# EasyEDA Pro project NRMgmtCRB_v2_final.epro, schematic Schematic1, sheets 2 to 3 of 3

## Sheets
2 Power
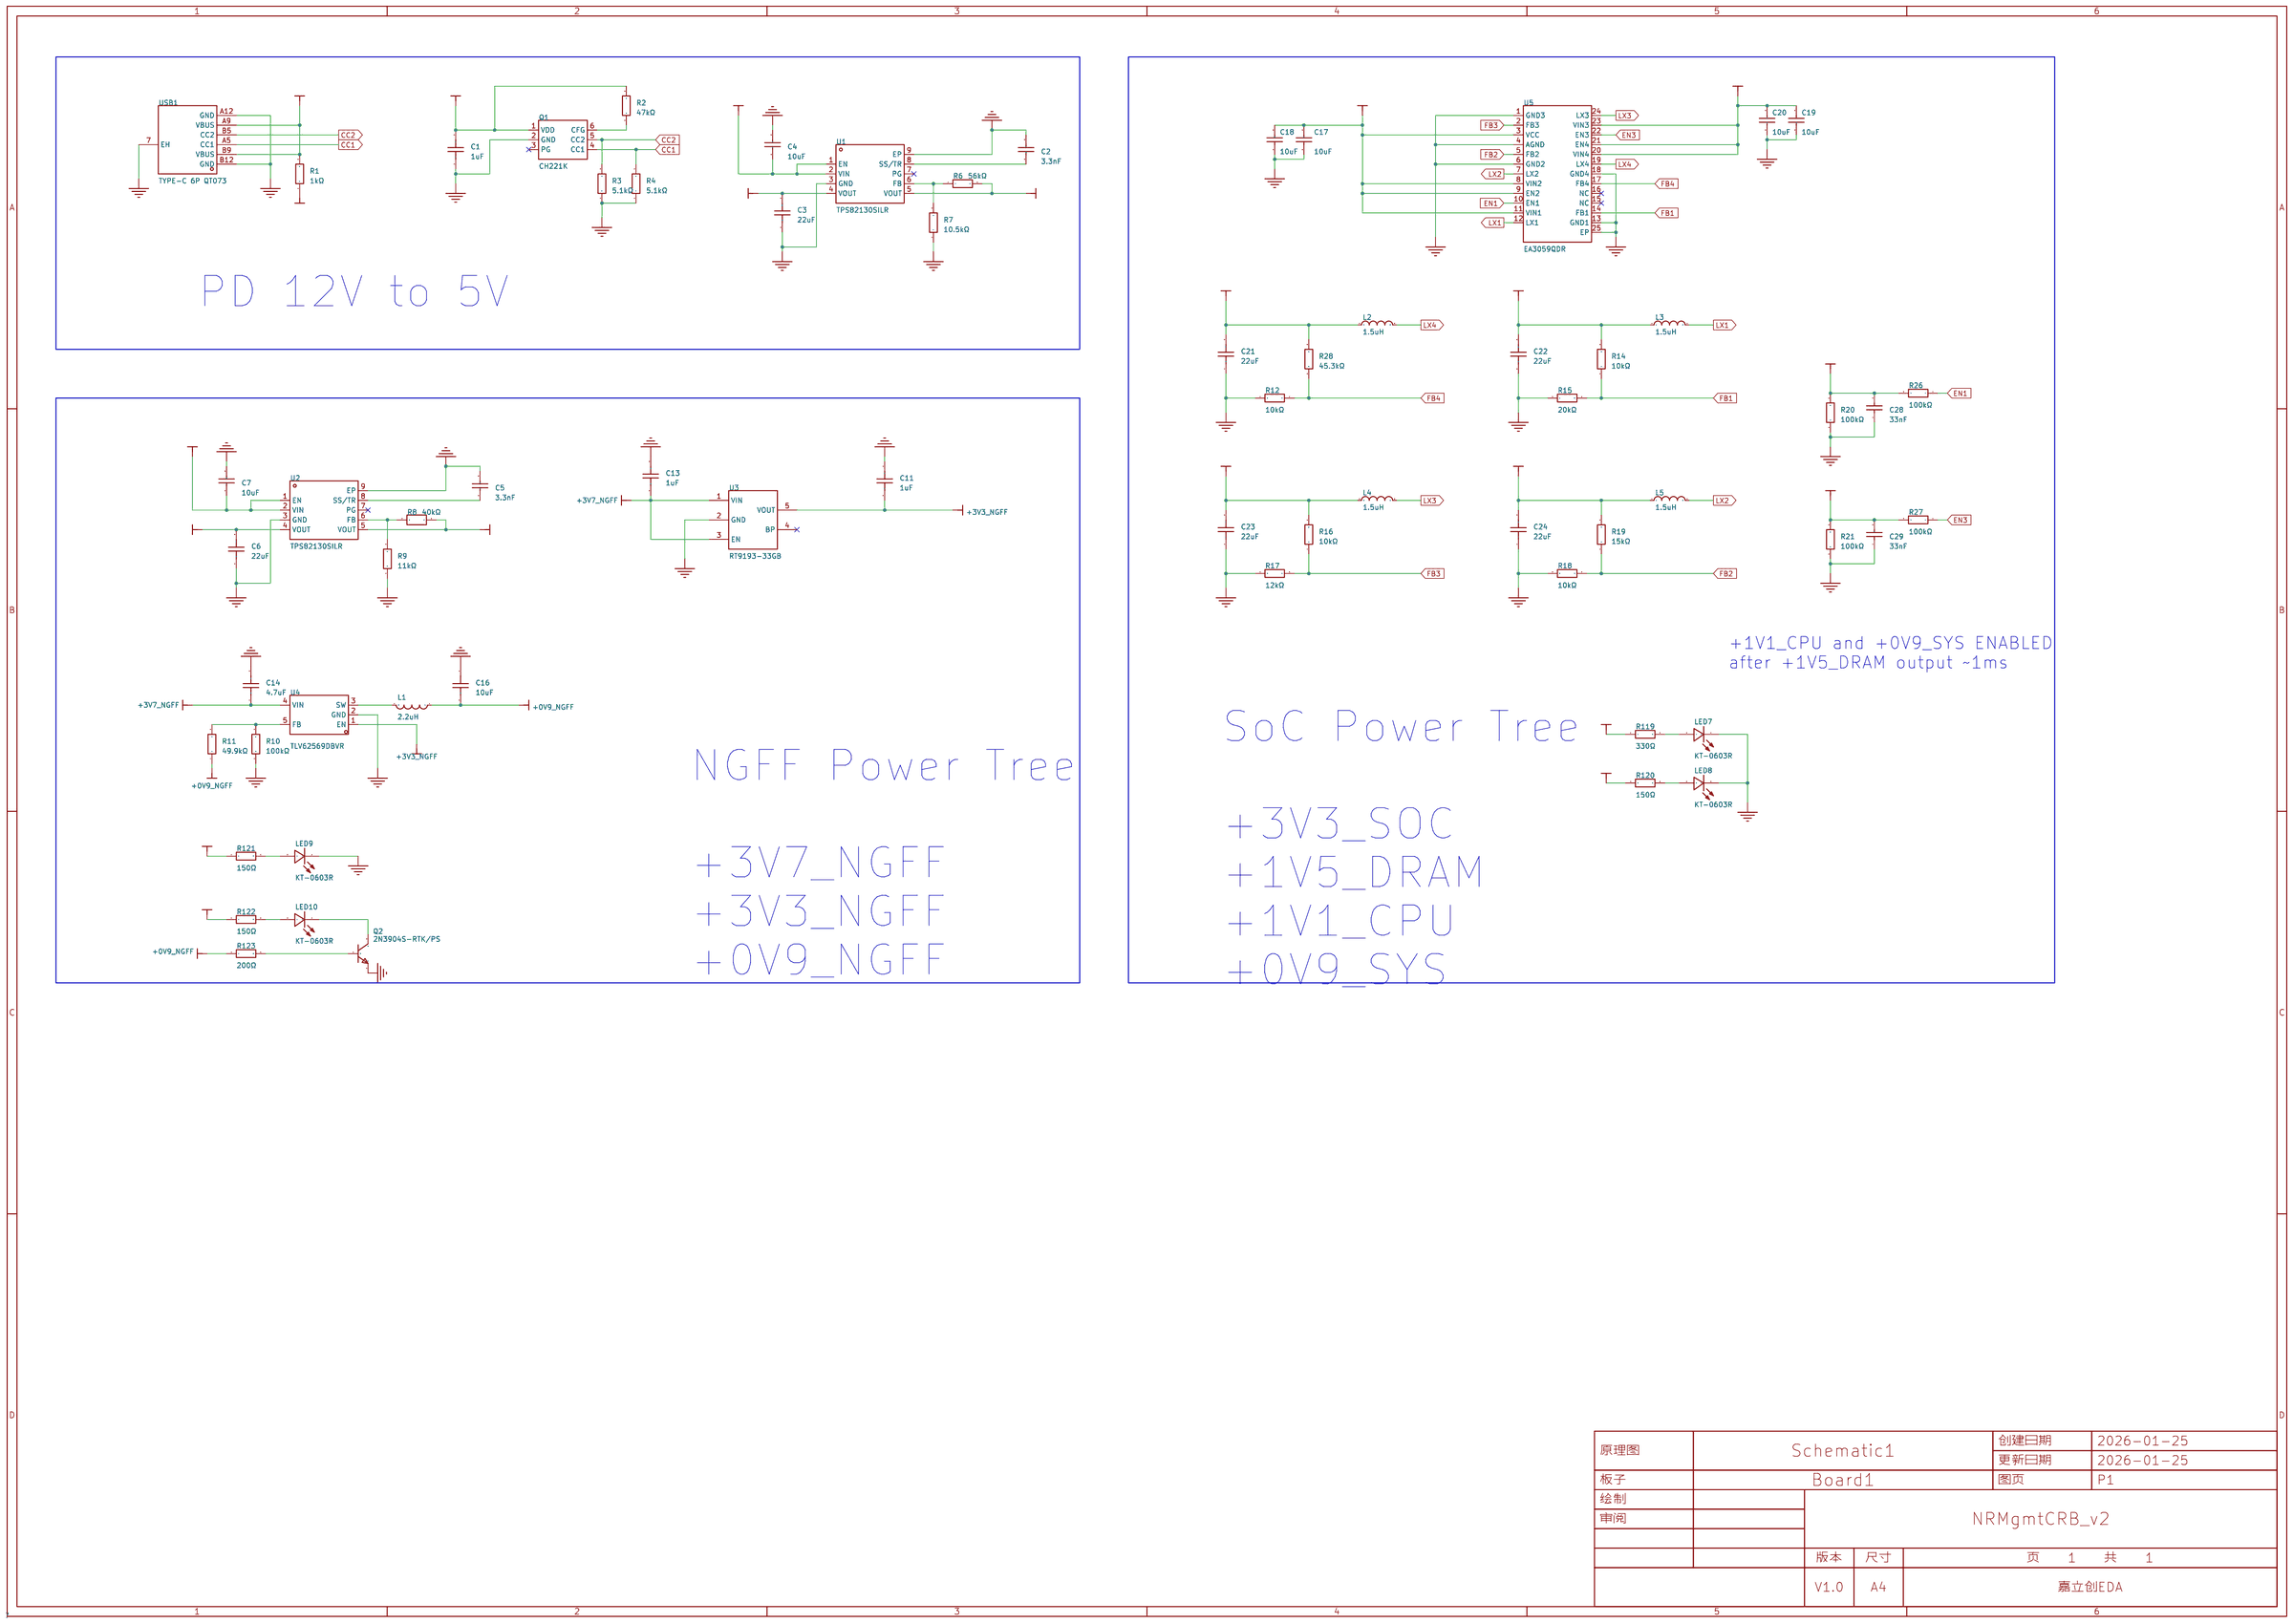
[diagram p1: Power]
3 NR
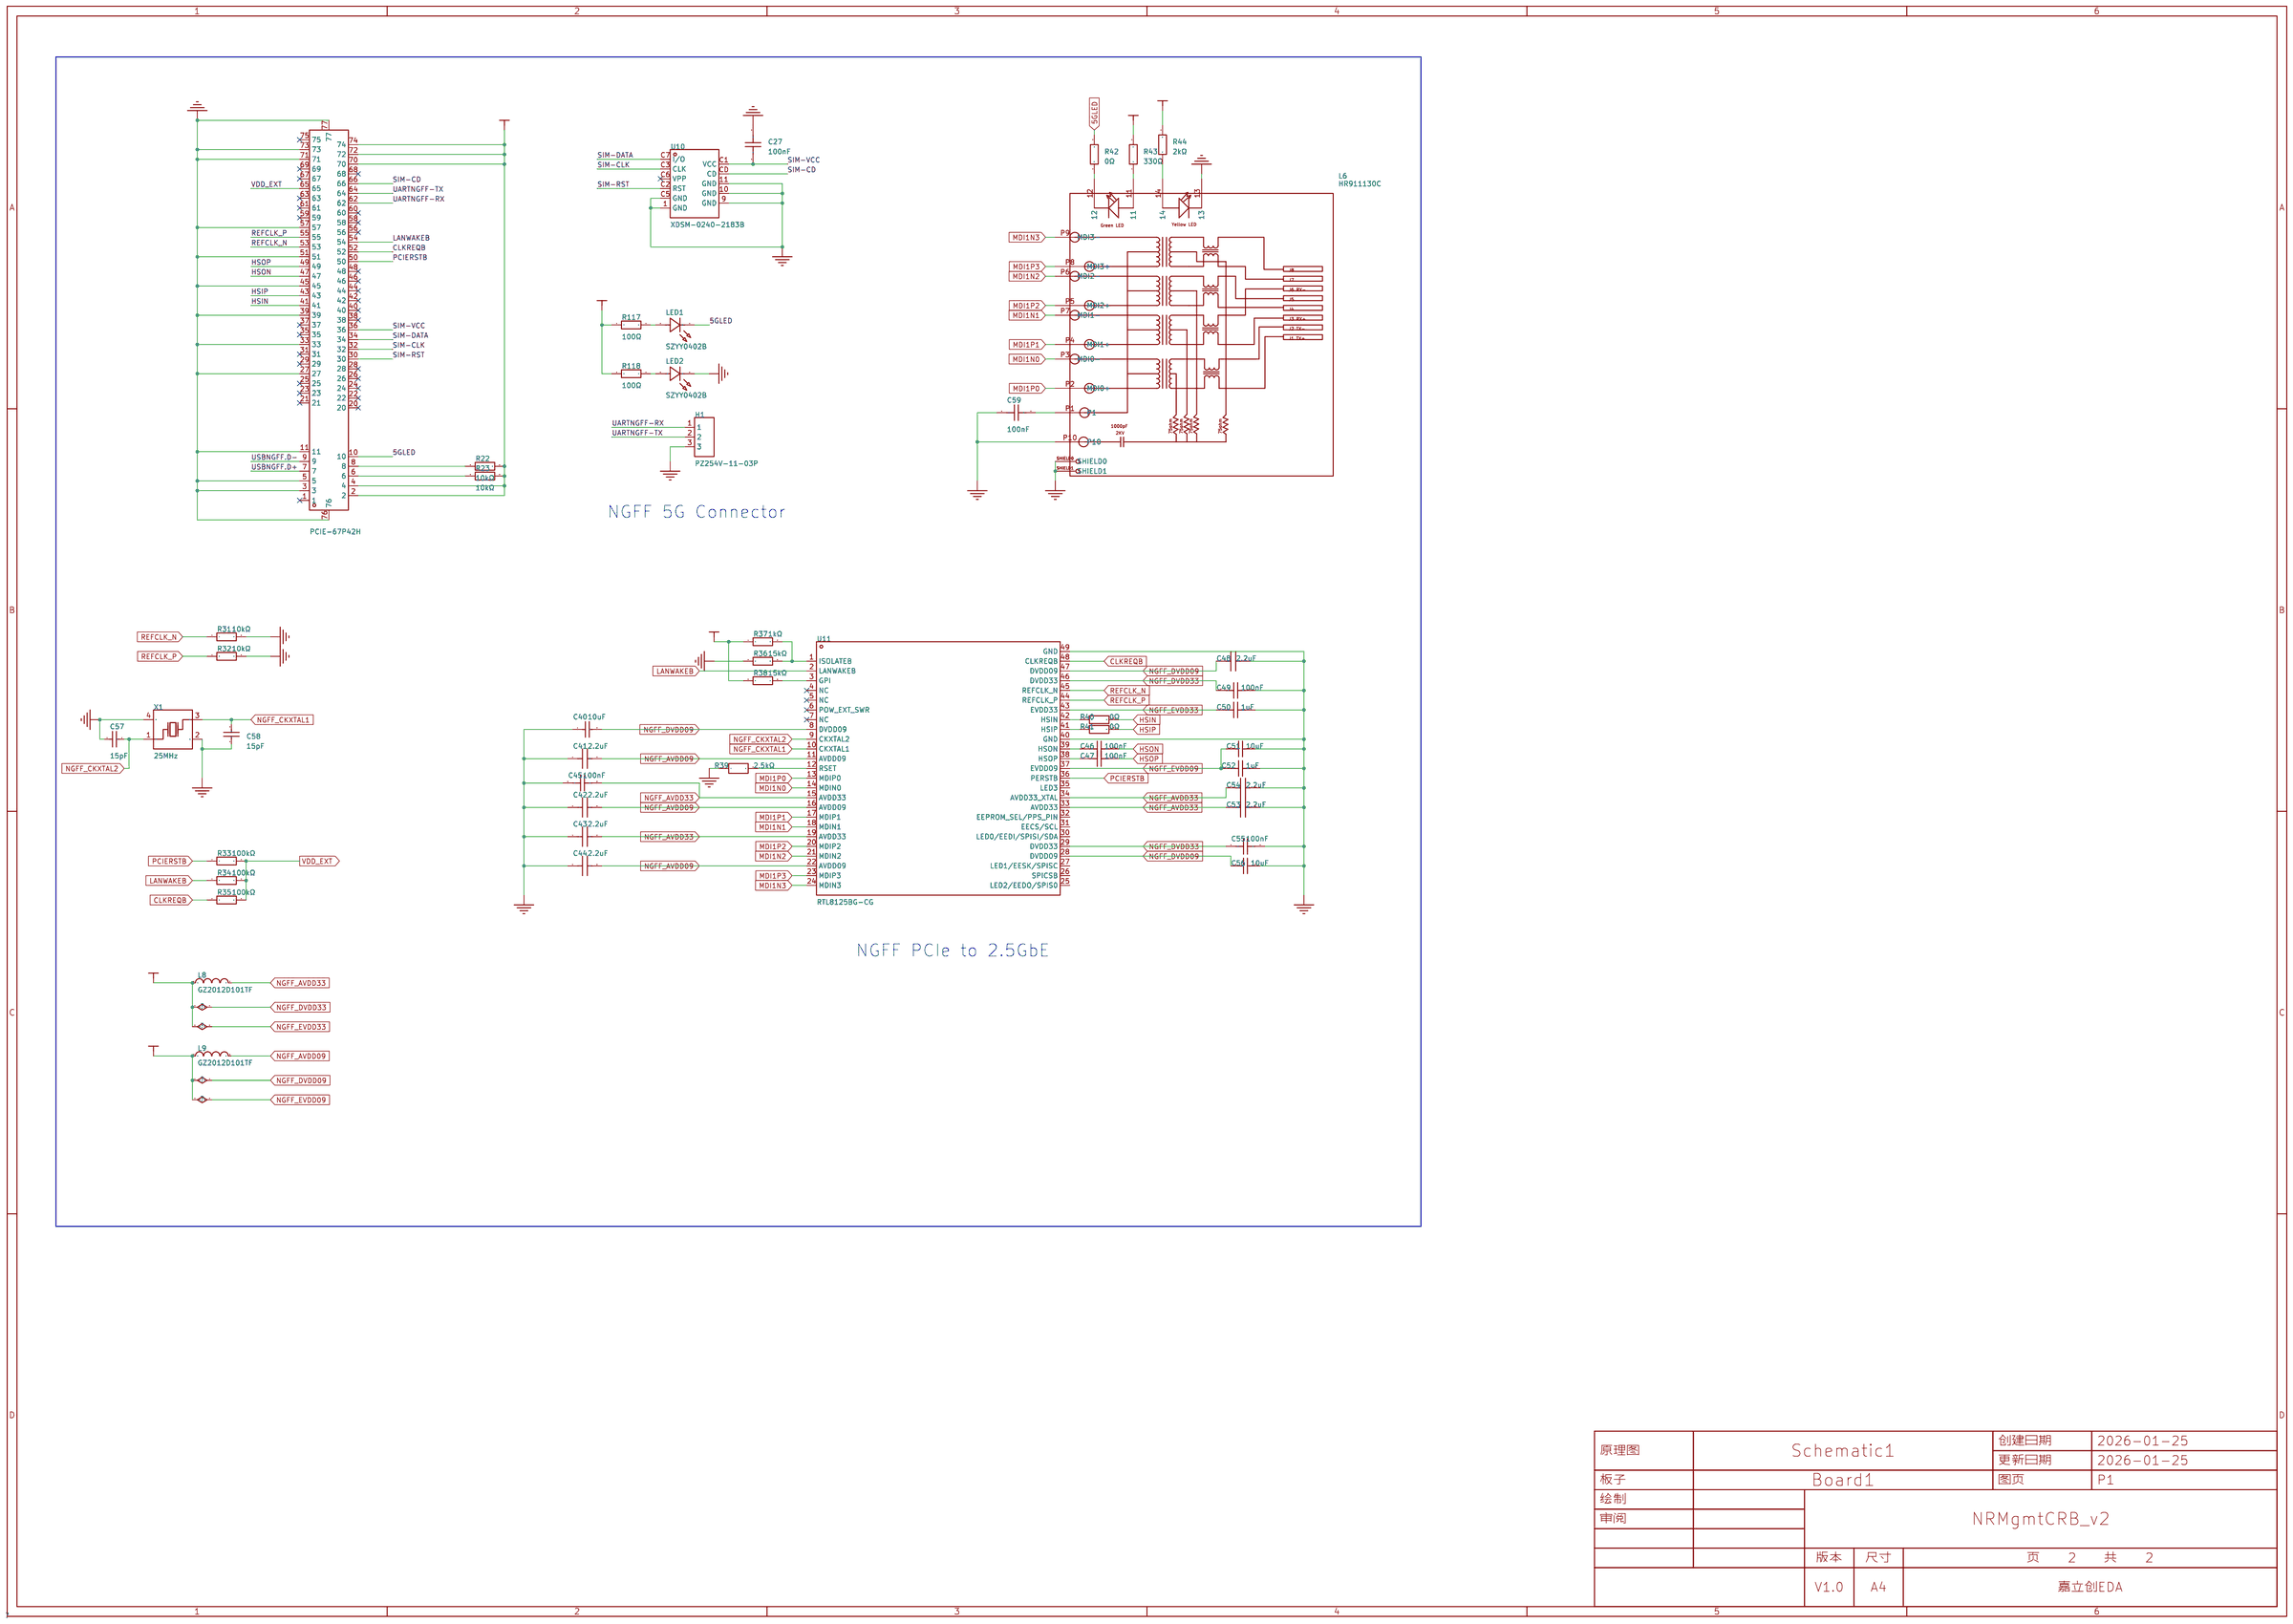
[diagram p2: NR]

## Parts
sheet NR
C27  100nF  [C0603]
C40  10uF  [C0402]
C41  2.2uF  [C0402]
C42  2.2uF  [C0402]
C43  2.2uF  [C0402]
C44  2.2uF  [C0402]
C45  100nF  [C0402]
C46  100nF  [C0402]
C47  100nF  [C0402]
C48  2.2uF  [C0402]
C49  100nF  [C0402]
C50  1uF  [C0402]
C51  10uF  [C0402]
C52  1uF  [C0402]
C53  2.2uF  [C0402]
C54  2.2uF  [C0402]
C55  100nF  [C0402]
C56  10uF  [C0402]
C57  15pF  [C0402]
C58  15pF  [C0402]
C59  100nF  [C0603]
H1  PZ254V-11-03P  [HDR-TH_3P-P2.54-V-M_PZ254V-11-03P]
L6  HR911130C  [RJ45-TH_HR911130C]
L8  GZ2012D101TF  [L0805]
L9  GZ2012D101TF  [L0805]
LED1  SZYY0402B  [LED0402-RD_BLUE]
LED2  SZYY0402B  [LED0402-RD_BLUE]
R22  10kΩ  [R0603]
R23  10kΩ  [R0603]
R31  10kΩ  [R0402]
R32  10kΩ  [R0402]
R33  100kΩ  [R0402]
R34  100kΩ  [R0402]
R35  100kΩ  [R0402]
R36  15kΩ  [R0402]
R37  1kΩ  [R0402]
R38  15kΩ  [R0402]
R39  2.5kΩ  [R0603]
R40  0Ω  [R0402]
R41  0Ω  [R0402]
R42  0Ω  [R0402]
R43  330Ω  [R0402]
R44  2kΩ  [R0402]
R117  100Ω  [R0402]
R118  100Ω  [R0402]
U6  PCIE-67P42H  [PCIE-SMD_75P-P0.50_HYC01B-05NGFF-420]
U10  XDSM-0240-2183B  [SIM-SMD_XDSM-0240-2183B]
U11  RTL8125BG-CG  [TQFN-48_L6.0-W6.0-P0.40-BL-EP4.5]
X1  25MHz  [CRYSTAL-SMD_4P-L3.2-W2.5-BL]
sheet Power
C1  1uF  [C0402]
C2  3.3nF  [C0603]
C3  22uF  [C0805]
C4  10uF  [C1206]
C5  3.3nF  [C0603]
C6  22uF  [C0805]
C7  10uF  [C1206]
C11  1uF  [C0603]
C13  1uF  [C0603]
C14  4.7uF  [C0805]
C16  10uF  [C0603]
C17  10uF  [C0402]
C18  10uF  [C0402]
C19  10uF  [C0402]
C20  10uF  [C0402]
C21  22uF  [C0603]
C22  22uF  [C0603]
C23  22uF  [C0603]
C24  22uF  [C0603]
C28  33nF  [C0603]
C29  33nF  [C0603]
L1  2.2uH  [IND-SMD_L2.5-W2.0_MHCHL2520]
L2  1.5uH  [IND-SMD_L2.5-W2.0_YXMBL252010P]
L3  1.5uH  [IND-SMD_L2.5-W2.0_YXMBL252010P]
L4  1.5uH  [IND-SMD_L2.5-W2.0_YXMBL252010P]
L5  1.5uH  [IND-SMD_L2.5-W2.0_YXMBL252010P]
LED7  KT-0603R  [LED0603-RD]
LED8  KT-0603R  [LED0603-RD]
LED9  KT-0603R  [LED0603-RD]
LED10  KT-0603R  [LED0603-RD]
Q1  CH221K  [SOT-23-6_L2.9-W1.6-P0.95-LS2.8-BL-2]
Q2  2N3904S-RTK/PS  [SOT-23-3_L2.9-W1.3-P1.90-LS2.4-TR]
R1  1kΩ  [R0402]
R2  47kΩ  [R0402]
R3  5.1kΩ  [R0402]
R4  5.1kΩ  [R0402]
R6  56kΩ  [R0603]
R7  10.5kΩ  [R0603]
R8  40kΩ  [R0603]
R9  11kΩ  [R0603]
R10  100kΩ  [R0603]
R11  49.9kΩ  [R0603]
R12  10kΩ  [R0402]
R14  10kΩ  [R0402]
R15  20kΩ  [R0402]
R16  10kΩ  [R0402]
R17  12kΩ  [R0402]
R18  10kΩ  [R0402]
R19  15kΩ  [R0402]
R20  100kΩ  [R0402]
R21  100kΩ  [R0402]
R26  100kΩ  [R0402]
R27  100kΩ  [R0402]
R28  45.3kΩ  [R0402]
R119  330Ω  [R0603]
R120  150Ω  [R0603]
R121  150Ω  [R0603]
R122  150Ω  [R0603]
R123  200Ω  [R0402]
U1  TPS82130SILR  [USIP-8_L3.0-W2.8-P0.65-TL-EP]
U2  TPS82130SILR  [USIP-8_L3.0-W2.8-P0.65-TL-EP]
U3  RT9193-33GB  [SOT-23-5_L3.0-W1.7-P0.95-LS2.8-BL]
U4  TLV62569DBVR  [SOT-23-5_L3.0-W1.7-P0.95-LS2.8-BR]
U5  EA3059QDR  [VQFN-24_L4.0-W4.0-P0.50-TL-EP2.5]
USB1  TYPE-C 6P QT073  [USB-C-SMD_TYPE-C-6P-QT073]

## Library data of the parts
C27 = CC0603KRX7R9BB104_1: 容值:100nF;精度:±10%;额定电压:50V;温度系数:X7R;; LCSC Part Name: 100nF ±10% 50V; Supplier Part: C14663; Manufacturer: YAGEO(国巨); Manufacturer Part: CC0603KRX7R9BB104; Supplier Footprint: 0603; JLCPCB Part Class: 基础库; Datasheet: https://item.szlcsc.com/datasheet/CC0603KRX7R9BB104/15331.html; Supplier: LCSC; Tolerance: ±10%; Voltage Rating: 50V; Temperature Coefficient: X7R; Check: false
C17-C20 C40 C51 C56 = CL05A106MQ5NUNC: 容值:10uF;精度:±20%;额定电压:6.3V;温度系数:X5R;; LCSC Part Name: 10uF ±20% 6.3V; Supplier Part: C15525; Manufacturer: SAMSUNG(三星); Supplier Footprint: 0402; JLCPCB Part Class: Basic Part; Datasheet: https://item.szlcsc.com/datasheet/CL05A106MQ5NUNC/16204.html; Supplier: LCSC; Tolerance: ±20%; Voltage Rating: 6.3V; Temperature Coefficient: X5R
C41-C44 C48 C53 C54 = CL05A225MQ5NSNC: 容值:2.2uF;精度:±20%;额定电压:6.3V;温度系数:X5R;; LCSC Part Name: 2.2uF ±20% 6.3V; Supplier Part: C12530; Manufacturer: SAMSUNG(三星); Supplier Footprint: 0402; JLCPCB Part Class: Basic Part; Datasheet: https://item.szlcsc.com/datasheet/CL05A225MQ5NSNC/13164.html; Supplier: LCSC; Tolerance: ±20%; Voltage Rating: 6.3V; Temperature Coefficient: X5R
C45-C47 C49 C55 = CL05B104KO5NNNC: 容值:100nF;精度:±10%;额定电压:16V;温度系数:X7R;; LCSC Part Name: 100nF ±10% 16V; Supplier Part: C1525; Manufacturer: SAMSUNG(三星); Supplier Footprint: 0402; JLCPCB Part Class: Basic Part; Datasheet: https://item.szlcsc.com/datasheet/CL05B104KO5NNNC/1877.html; Supplier: LCSC; Tolerance: ±10%; Voltage Rating: 16V; Temperature Coefficient: X7R
C1 C50 C52 = CL05A105KA5NQNC: 容值:1uF;精度:±10%;额定电压:25V;温度系数:X5R;; LCSC Part Name: 1uF ±10% 25V; Supplier Part: C52923; Manufacturer: SAMSUNG(三星); Supplier Footprint: 0402; JLCPCB Part Class: Basic Part; Datasheet: https://item.szlcsc.com/datasheet/CL05A105KA5NQNC/53938.html; Supplier: LCSC; Tolerance: ±10%; Voltage Rating: 25V; Temperature Coefficient: X5R
C57 C58 = GJM1555C1H150FB01D: 容值:15pF;精度:±1%;额定电压:50V;材质(温度系数):C0G;; LCSC Part Name: 15pF ±1% 50V; Supplier Part: C441742; Manufacturer: muRata(村田); Supplier Footprint: 0402; JLCPCB Part Class: Extended Part; Datasheet: https://atta.szlcsc.com/upload/public/pdf/source/20200305/C490387_23319AE8C154DEB24C505E6C82A8106A.pdf; Supplier: LCSC; Tolerance: ±1%; Voltage Rated: 50V; Temperature Coefficient: C0G
C59 = CC0603KRX7R9BB104_1: 容值:100nF;精度:±10%;额定电压:50V;温度系数:X7R;; LCSC Part Name: 100nF ±10% 50V; Supplier Part: C14663; Manufacturer: YAGEO(国巨); Manufacturer Part: CC0603KRX7R9BB104; Supplier Footprint: 0603; JLCPCB Part Class: 基础库; Datasheet: https://item.szlcsc.com/datasheet/CC0603KRX7R9BB104/15331.html; Supplier: LCSC; Tolerance: ±10%; Voltage Rating: 50V; Temperature Coefficient: X7R
H1 = PZ254V-11-03P: 插针结构:1x3P;间距:2.54mm;行距:-;圆针/方针:方针;安装方式:直插;排数:单排;总PIN位数:3P;额定电流:3A;额定电压:250V;配合针长度:6mm;塑高:2.5mm;端接针长度:3mm;工作温度:-40℃~+105℃;颜色:黑色;; LCSC Part Name: 1x3P 间距:2.54mm 方针 直插; Supplier Part: C2937625; Manufacturer: XFCN(兴飞); Supplier Footprint: 插件,P=2.54mm; JLCPCB Part Class: Extended Part; Datasheet: https://item.szlcsc.com/datasheet/PZ254V-11-03P/3293280.html; Supplier: LCSC; Pin Structure: 1x3P; Pitch: 2.54mm; Circluar Pins/Square Pins: 方针; Mounting Type: 直插; Number of Rows: 单排; Number of Pins: 3P; Current Rating: 3A; Voltage Rating (Max): 250V; Length of Mating Pin: 6mm; Insulation Height: 2.5mm; Length of End Connection Pin: 3mm; Operating Temperature: -40℃~+105℃; Color: 黑色
L6 = HR911130C: 连接器类型:RJ45插座;安装方式:弯插;端口数量:1;LED:带LED;屏蔽:有屏蔽;等级:-;触头材质:磷青铜;触头镀层:金;工作温度:0℃~+70℃;; LCSC Part Name: 弯插 带LED; Supplier Part: C50933; Manufacturer: HANRUN(汉仁); Supplier Footprint: 弯插; JLCPCB Part Class: Extended Part; Datasheet: https://item.szlcsc.com/datasheet/HR911130C/51945.html; Supplier: LCSC; Connector Type: RJ45插座; Mounting Type: 弯插; Number of Ports: 1; LED: 带LED; Shielding: 有屏蔽; PoE: 不带PoE; Contact Material: 磷青铜; Contact Plating: 金; Operating Temperature: 0℃~+70℃
L8 L9 = GZ2012D101TF: 阻抗@频率:100Ω@100MHz;误差:±25%;直流电阻(DCR):150mΩ;; LCSC Part Name: 单路 0805磁珠 阻抗100Ω@100MHz; Supplier Part: C1015; Manufacturer: Sunlord(顺络); Supplier Footprint: 0805; JLCPCB Part Class: Basic Part; Datasheet: https://item.szlcsc.com/datasheet/GZ2012D101TF/1367.html; Supplier: LCSC; Impedance @ Frequency: 100Ω@100MHz; Tolerance: ±25%; DC Resistance(DCR): 150mΩ; Current Rating: 800mA; Number of Circuits: 1; Operating Temperature: -55℃~+125℃
LED1 LED2 = SZYY0402B: 发光颜色:蓝色;功率:-;正向电流:5mA;主波长:466nm~469nm;色温:-;发光角度:120°;载带方式:-;工作温度:-40℃~+85℃;; LCSC Part Name: 蓝灯; Supplier Part: C434447; Manufacturer: yongyu(永裕光电); Supplier Footprint: 0402; JLCPCB Part Class: Extended Part; Datasheet: https://atta.szlcsc.com/upload/public/pdf/source/20210222/C434447_30232BB6183B52026028ECA50B9DAB35.pdf; Supplier: LCSC; Emitted Color: 蓝色; Forward Current: 5mA; Dominant Wavelength: 466nm~469nm; Viewing Angle: 120°; Operating Temperature: -40℃~+85℃
R22 R23 = 0603WAF1002T5E: 电阻类型:厚膜电阻;阻值:10kΩ;精度:±1%;功率:100mW;工作电压:75V;温度系数:±100ppm/℃;; LCSC Part Name: 厚膜电阻 10kΩ ±1% 100mW; Supplier Part: C25804; Manufacturer: UNI-ROYAL(厚声); Supplier Footprint: 0603; JLCPCB Part Class: Basic Part; Datasheet: https://item.szlcsc.com/datasheet/0603WAF1002T5E/26547.html; Supplier: LCSC; Type: 厚膜电阻; Tolerance: ±1%; Power(Watts): 100mW; Voltage-Supply(Max): 75V; Temperature Coefficient: ±100ppm/℃; Operating Temperature: -55℃~+155℃
R12 R14 R16 R18 R31 R32 = 0402WGF1002TCE: 电阻类型:厚膜电阻;阻值:10kΩ;精度:±1%;功率:62.5mW;工作电压:50V;温度系数:±100ppm/℃;; LCSC Part Name: 10kΩ ±1% 62.5mW 厚膜电阻; Supplier Part: C25744; Manufacturer: UNI-ROYAL(厚声); Supplier Footprint: 0402; JLCPCB Part Class: Basic Part; Datasheet: https://item.szlcsc.com/datasheet/0402WGF1002TCE/26487.html; Supplier: LCSC; Type: 厚膜电阻; Tolerance: ±1%; Power(Watts): 62.5mW; Voltage-Supply(Max): 50V; Temperature Coefficient: ±100ppm/℃; Operating Temperature: -55℃~+155℃
R20 R21 R26 R27 R33-R35 = 0402WGF1003TCE: 电阻类型:厚膜电阻;阻值:100kΩ;精度:±1%;功率:62.5mW;工作电压:50V;温度系数:±100ppm/℃;; LCSC Part Name: 100kΩ ±1% 62.5mW 厚膜电阻; Supplier Part: C25741; Manufacturer: UNI-ROYAL(厚声); Supplier Footprint: 0402; JLCPCB Part Class: Basic Part; Datasheet: https://item.szlcsc.com/datasheet/0402WGF1003TCE/26484.html; Supplier: LCSC; Type: 厚膜电阻; Tolerance: ±1%; Power(Watts): 62.5mW; Voltage-Supply(Max): 50V; Temperature Coefficient: ±100ppm/℃; Operating Temperature: -55℃~+155℃
R19 R36 R38 = 0402WGF1502TCE: 电阻类型:厚膜电阻;阻值:15kΩ;精度:±1%;功率:62.5mW;最大工作电压:50V;温度系数:±100ppm/℃;; LCSC Part Name: 15kΩ ±1% 62.5mW 厚膜电阻; Supplier Part: C25756; Manufacturer: UNI-ROYAL(厚声); Supplier Footprint: 0402; JLCPCB Part Class: Basic Part; Datasheet: https://atta.szlcsc.com/upload/public/pdf/source/20200306/C422600_1E6D84923E4A46A82E41ADD87F860B5C.pdf; Supplier: LCSC; Type: 厚膜电阻; Tolerance: ±1%; Power(Watts): 62.5mW; Overload Voltage (Max): 50V; Temperature Coefficient: ±100ppm/℃; Operating Temperature Range: -55℃~+155℃
R1 R37 = 0402WGF1001TCE: 电阻类型:厚膜电阻;阻值:1kΩ;精度:±1%;功率:62.5mW;工作电压:50V;温度系数:±100ppm/℃;; LCSC Part Name: 1kΩ ±1% 62.5mW 厚膜电阻; Supplier Part: C11702; Manufacturer: UNI-ROYAL(厚声); Supplier Footprint: 0402; JLCPCB Part Class: Basic Part; Datasheet: https://item.szlcsc.com/datasheet/0402WGF1001TCE/12256.html; Supplier: LCSC; Type: 厚膜电阻; Tolerance: ±1%; Power(Watts): 62.5mW; Voltage-Supply(Max): 50V; Temperature Coefficient: ±100ppm/℃; Operating Temperature: -55℃~+155℃
R39 = AR03BTCX2501: 电阻类型:薄膜电阻;阻值:2.5kΩ;精度:±0.1%;功率:100mW;工作电压:-;温度系数:±25ppm/℃;; LCSC Part Name: 薄膜电阻 2.5kΩ ±0.1% 100mW; Supplier Part: C2984338; Manufacturer: Viking(光颉); Supplier Footprint: 0603; JLCPCB Part Class: Extended Part; Datasheet: https://item.szlcsc.com/datasheet/AR03BTCX2501/3425873.html; Supplier: LCSC; Type: 薄膜电阻; Tolerance: ±0.1%; Power(Watts): 100mW; Temperature Coefficient: ±25ppm/℃; Operating Temperature: -55℃~+155℃
R40-R42 = 0402WGF0000TCE: 电阻类型:厚膜电阻;阻值:0Ω;精度:±1%;功率:62.5mW;工作电压:50V;温度系数:±800ppm/℃;; LCSC Part Name: 0Ω ±1% 62.5mW 厚膜电阻; Supplier Part: C17168; Manufacturer: UNI-ROYAL(厚声); Supplier Footprint: 0402; JLCPCB Part Class: Basic Part; Datasheet: https://item.szlcsc.com/datasheet/0402WGF0000TCE/17853.html; Supplier: LCSC; Type: 厚膜电阻; Tolerance: ±1%; Power(Watts): 62.5mW; Voltage-Supply(Max): 50V; Temperature Coefficient: ±800ppm/℃; Operating Temperature: -55℃~+155℃
R43 = 0402WGF3300TCE: 电阻类型:厚膜电阻;阻值:330Ω;精度:±1%;功率:62.5mW;工作电压:50V;温度系数:±100ppm/℃;; LCSC Part Name: 330Ω ±1% 62.5mW 厚膜电阻; Supplier Part: C25104; Manufacturer: UNI-ROYAL(厚声); Supplier Footprint: 0402; JLCPCB Part Class: Basic Part; Datasheet: https://item.szlcsc.com/datasheet/0402WGF3300TCE/25847.html; Supplier: LCSC; Type: 厚膜电阻; Tolerance: ±1%; Power(Watts): 62.5mW; Voltage-Supply(Max): 50V; Temperature Coefficient: ±100ppm/℃; Operating Temperature: -55℃~+155℃
R44 = 0402WGF2001TCE: 电阻类型:厚膜电阻;阻值:2kΩ;精度:±1%;功率:62.5mW;最大工作电压:50V;温度系数:±100ppm/℃;; LCSC Part Name: 2kΩ ±1% 62.5mW 厚膜电阻; Supplier Part: C4109; Manufacturer: UNI-ROYAL(厚声); Supplier Footprint: 0402; JLCPCB Part Class: Basic Part; Datasheet: https://atta.szlcsc.com/upload/public/pdf/source/20200306/C422600_1E6D84923E4A46A82E41ADD87F860B5C.pdf; Supplier: LCSC; Type: 厚膜电阻; Tolerance: ±1%; Power(Watts): 62.5mW; Overload Voltage (Max): 50V; Temperature Coefficient: ±100ppm/℃; Operating Temperature Range: -55℃~+155℃
R117 R118 = 0402WGF1000TCE: 电阻类型:厚膜电阻;阻值:100Ω;精度:±1%;功率:62.5mW;最大工作电压:50V;温度系数:±200ppm/℃;; LCSC Part Name: 100Ω ±1% 62.5mW 厚膜电阻; Supplier Part: C25076; Manufacturer: UNI-ROYAL(厚声); Supplier Footprint: 0402; JLCPCB Part Class: Basic Part; Datasheet: https://atta.szlcsc.com/upload/public/pdf/source/20200306/C422600_1E6D84923E4A46A82E41ADD87F860B5C.pdf; Supplier: LCSC; Type: 厚膜电阻; Tolerance: ±1%; Power(Watts): 62.5mW; Overload Voltage (Max): 50V; Temperature Coefficient: ±200ppm/℃; Operating Temperature Range: -55℃~+155℃
U6 = PCIE-67P42H: M.2连接器 尺寸超薄 尺寸小型MICRO 镀金加强 贴片立式; Supplier Part: C19188865; Manufacturer: SOFNG(硕方); Supplier Footprint: SMD,P=0.5mm,卧贴; JLCPCB Part Class: 扩展库; Datasheet: https://atta.szlcsc.com/upload/public/pdf/source/20231103/B9BD9307E4B626B1E337F5C6EDD652C3.pdf; Supplier: LCSC; Check: false
U10 = XDSM-0240-2183B: 卡连接方式:自弹式;卡类型:NanoSIM卡;本体最大高度:1.35mm;工作温度:-40℃~+85℃;; LCSC Part Name: 升级防溃PIN Nano SIM卡座6+1PIN自弹式防反插 无柱; Supplier Part: C7498090; Manufacturer: LX(连欣科技); Supplier Footprint: SMD; JLCPCB Part Class: 扩展库; Datasheet: https://item.szlcsc.com/datasheet/XDSM-0240-2183B/8568532.html; Supplier: LCSC; Card Connection Mode: 自弹式; Card Type: NanoSIM卡; Height Above Board: 1.35mm; Operating Temperature: -40℃~+85℃; Check: false
U11 = RTL8125BG-CG: 应用功能:-;通道数:-;MAC接口:PCIe;; LCSC Part Name: 集成10/100/1000M/2.5G以太网控制器，适用于PCI Express应用; Supplier Part: C3013605; Manufacturer: REALTEK(瑞昱); Supplier Footprint: QFN-48-EP(6x6); JLCPCB Part Class: Extended Part; Supplier: LCSC; MAC Interface: PCIe; Voltage - Supply: 3.3V；950mV; Operating Temperature: 0℃~+70℃
X1 = XXCEELNANF-25MHZ: 晶振类型:贴片晶振;频率:25MHz;常温频差:±30ppm;负载电容:10pF;频率稳定度:±30ppm;; LCSC Part Name: 25MHz ±30ppm 10pF; Supplier Part: C117869; Manufacturer: TAITIEN(泰艺电子); Supplier Footprint: SMD3225-4P; JLCPCB Part Class: 扩展库; Datasheet: https://item.szlcsc.com/datasheet/XXCEELNANF-25MHZ/119128.html; Supplier: LCSC; Type: 贴片晶振; Normal temperature Frequency Tolerance: ±30ppm; Load Capacitance: 10pF; Frequency Stability: ±30ppm; Operating Temperature: -40℃~+85℃; Check: false
C2 C5 = CL10B332KB8NNNC: 容值:3.3nF;精度:±10%;额定电压:50V;温度系数:X7R;; LCSC Part Name: 3.3nF ±10% 50V; Supplier Part: C1613; Manufacturer: SAMSUNG(三星); Supplier Footprint: 0603; JLCPCB Part Class: Basic Part; Datasheet: https://item.szlcsc.com/datasheet/CL10B332KB8NNNC/1965.html; Supplier: LCSC; Tolerance: ±10%; Voltage Rating: 50V; Temperature Coefficient: X7R
C3 C6 = CL21A226MAQNNNE: 容值:22uF;精度:±20%;额定电压:25V;温度系数:X5R;; LCSC Part Name: 22uF ±20% 25V; Supplier Part: C45783; Manufacturer: SAMSUNG(三星); Supplier Footprint: 0805; JLCPCB Part Class: Basic Part; Datasheet: https://item.szlcsc.com/datasheet/CL21A226MAQNNNE/46786.html; Supplier: LCSC; Tolerance: ±20%; Voltage Rating: 25V; Temperature Coefficient: X5R
C4 C7 = CL31A106KBHNNNE: 容值:10uF;精度:±10%;额定电压:50V;温度系数:X5R;; LCSC Part Name: 10uF ±10% 50V; Supplier Part: C13585; Manufacturer: SAMSUNG(三星); Supplier Footprint: 1206; JLCPCB Part Class: Basic Part; Datasheet: https://item.szlcsc.com/datasheet/CL31A106KBHNNNE/14236.html; Supplier: LCSC; Tolerance: ±10%; Voltage Rating: 50V; Temperature Coefficient: X5R
C11 C13 = CL10A105KB8NNNC: 容值:1uF;精度:±10%;额定电压:50V;温度系数:X5R;; LCSC Part Name: 1uF ±10% 50V; Supplier Part: C15849; Manufacturer: SAMSUNG(三星); Supplier Footprint: 0603; JLCPCB Part Class: 基础库; Datasheet: https://item.szlcsc.com/datasheet/CL10A105KB8NNNC/16531.html; Supplier: LCSC; Tolerance: ±10%; Voltage Rating: 50V; Temperature Coefficient: X5R; Check: false
C14 = CGA0805X7R475K350MT: 容值:4.7uF;精度:±10%;额定电压:35V;材质(温度系数):X7R;; LCSC Part Name: 4.7uF ±10% 35V; Supplier Part: C6119943; Manufacturer: HRE(芯声); Supplier Footprint: 0805; JLCPCB Part Class: 扩展库; Supplier: LCSC; Tolerance: ±10%; Voltage Rated: 35V; Temperature Coefficient: X7R; Check: false
C16 = CL10A106KP8NNNC: 容值:10uF;精度:±10%;额定电压:10V;温度系数:X5R;; LCSC Part Name: 10uF ±10% 10V; Supplier Part: C19702; Manufacturer: SAMSUNG(三星); Supplier Footprint: 0603; JLCPCB Part Class: 基础库; Datasheet: https://item.szlcsc.com/datasheet/CL10A106KP8NNNC/20411.html; Supplier: LCSC; Tolerance: ±10%; Voltage Rating: 10V; Temperature Coefficient: X5R; Check: false
C21-C24 = CL10A226MQ8NRNC: 容值:22uF;精度:±20%;额定电压:6.3V;温度系数:X5R;; LCSC Part Name: 22uF ±20% 6.3V; Supplier Part: C59461; Manufacturer: SAMSUNG(三星); Supplier Footprint: 0603; JLCPCB Part Class: Basic Part; Datasheet: https://item.szlcsc.com/datasheet/CL10A226MQ8NRNC/60514.html; Supplier: LCSC; Tolerance: ±20%; Voltage Rating: 6.3V; Temperature Coefficient: X5R
C28 C29 = CL10B333KB8NNNC: 容值:33nF;精度:±10%;额定电压:50V;温度系数:X7R;; LCSC Part Name: 33nF ±10% 50V; Supplier Part: C21117; Manufacturer: SAMSUNG(三星); Supplier Footprint: 0603; JLCPCB Part Class: Basic Part; Datasheet: https://item.szlcsc.com/datasheet/CL10B333KB8NNNC/21829.html; Supplier: LCSC; Tolerance: ±10%; Voltage Rating: 50V; Temperature Coefficient: X7R
L1 = FTC252012S2R2MBCA: 电感值:2.2uH;精度:±20%;额定电流:3A;饱和电流(Isat):3.8A;类型:一体成型电感;; LCSC Part Name: 2.2uH ±20% 3.8A; Supplier Part: C5832372; Manufacturer: cjiang(长江微电); Supplier Footprint: 1008; JLCPCB Part Class: 扩展库; Datasheet: https://atta.szlcsc.com/upload/public/pdf/source/20230602/8FFEDA9C0247A92A0D4B67554BFE4091.pdf; Supplier: LCSC; Tolerance: ±20%; Rated Current: 3A; Saturation Current (Isat): 3.8A; DC Resistance (DCR): 55mΩ; Type: 一体成型电感; Check: false
L2-L5 = FWP252010P-1R5ML: 电感值:1.5uH;精度:±20%;额定电流:2.5A;饱和电流(Isat):2.6A;类型:磁胶屏蔽电感;; LCSC Part Name: 1.5uH ±20% 2.6A; Supplier Part: C5179452; Manufacturer: cjiang(长江微电); Supplier Footprint: 1008; JLCPCB Part Class: Extended Part; Datasheet: https://item.szlcsc.com/datasheet/FWP252010P-1R5ML/5835627.html; Supplier: LCSC; Tolerance: ±20%; Current Rating: 2.5A; Current - Saturation(Isat): 2.6A; DC Resistance(DCR): 76mΩ; Type: 磁胶屏蔽电感
LED7-LED10 = KT-0603R: 发光颜色:红色;功率:-;正向电流:-;主波长:-;二极管配置:-;透镜颜色:-;色温:-;发光角度:-;载带方式:-;工作温度:-40℃~+85℃;; LCSC Part Name: 0603 红灯 高亮; Supplier Part: C2286; Manufacturer: KENTO; Supplier Footprint: 0603; JLCPCB Part Class: Basic Part; Datasheet: https://atta.szlcsc.com/upload/public/pdf/source/20160616/1466072038404.pdf; Supplier: LCSC; Emitted Color: 红色; Operating Temperature: -40℃~+85℃
Q1 = CH221K: Supplier Part: C5125736; Manufacturer: WCH(南京沁恒); Supplier Footprint: SOT-23-6; JLCPCB Part Class: Extended Part; Datasheet: https://item.szlcsc.com/datasheet/CH221K/5724821.html; Supplier: LCSC
Q2 = 2N3904S-RTK/PS: 晶体管类型:NPN;集电极电流(Ic):200mA;集射极击穿电压(Vceo):40V;耗散功率(Pd):350mW;直流电流增益(hFE):100@10mA,1V;; LCSC Part Name: NPN 电流:200mA 电压:40V; Supplier Part: C18536; Manufacturer: KEC; Supplier Footprint: SOT-23; JLCPCB Part Class: Extended Part; Datasheet: https://item.szlcsc.com/datasheet/2N3904S-RTK%252FPS/19236.html; Supplier: LCSC; type: NPN; Current - Collector(Ic): 200mA; Collector - Emitter Voltage VCEO: 40V; Pd - Power Dissipation: 350mW; DC Current Gain: 100@10mA,1V; Transition frequency(fT): 300MHz; Current - Collector Cutoff: 50nA; Vce Saturation(VCE(sat)): 300mV; Emitter-Base Voltage(Vebo): 6V
R2 = 0402WGF4702TCE: 电阻类型:厚膜电阻;阻值:47kΩ;精度:±1%;功率:62.5mW;工作电压:50V;温度系数:±100ppm/℃;; LCSC Part Name: 47kΩ ±1% 62.5mW 厚膜电阻; Supplier Part: C25792; Manufacturer: UNI-ROYAL(厚声); Supplier Footprint: 0402; JLCPCB Part Class: Basic Part; Datasheet: https://item.szlcsc.com/datasheet/0402WGF4702TCE/26535.html; Supplier: LCSC; Type: 厚膜电阻; Tolerance: ±1%; Power(Watts): 62.5mW; Voltage-Supply(Max): 50V; Temperature Coefficient: ±100ppm/℃; Operating Temperature: -55℃~+155℃
R3 R4 = 0402WGF5101TCE: 电阻类型:厚膜电阻;阻值:5.1kΩ;精度:±1%;功率:62.5mW;工作电压:50V;温度系数:±100ppm/℃;; LCSC Part Name: 5.1kΩ ±1% 62.5mW 厚膜电阻; Supplier Part: C25905; Manufacturer: UNI-ROYAL(厚声); Supplier Footprint: 0402; JLCPCB Part Class: Basic Part; Datasheet: https://item.szlcsc.com/datasheet/0402WGF5101TCE/26648.html; Supplier: LCSC; Type: 厚膜电阻; Tolerance: ±1%; Power(Watts): 62.5mW; Voltage-Supply(Max): 50V; Temperature Coefficient: ±100ppm/℃; Operating Temperature: -55℃~+155℃
R6 = 0603WAF5602T5E: 电阻类型:厚膜电阻;阻值:56kΩ;精度:±1%;功率:100mW;工作电压:75V;温度系数:±100ppm/℃;; LCSC Part Name: 56kΩ ±1% 100mW 厚膜电阻; Supplier Part: C23206; Manufacturer: UNI-ROYAL(厚声); Supplier Footprint: 0603; JLCPCB Part Class: Basic Part; Datasheet: https://item.szlcsc.com/datasheet/0603WAF5602T5E/23933.html; Supplier: LCSC; Type: 厚膜电阻; Tolerance: ±1%; Power(Watts): 100mW; Voltage-Supply(Max): 75V; Temperature Coefficient: ±100ppm/℃; Operating Temperature: -55℃~+155℃
R7 = 0603WAF1052T5E: 电阻类型:厚膜电阻;阻值:10.5kΩ;精度:±1%;功率:100mW;工作电压:75V;温度系数:±100ppm/℃;; LCSC Part Name: 10.5kΩ ±1% 100mW 厚膜电阻; Supplier Part: C22855; Manufacturer: UNI-ROYAL(厚声); Supplier Footprint: 0603; JLCPCB Part Class: Extended Part; Datasheet: https://item.szlcsc.com/datasheet/0603WAF1052T5E/23582.html; Supplier: LCSC; Type: 厚膜电阻; Tolerance: ±1%; Power(Watts): 100mW; Voltage-Supply(Max): 75V; Temperature Coefficient: ±100ppm/℃; Operating Temperature: -55℃~+155℃
R8 = RT0603BRD0740KL: 电阻类型:薄膜电阻;阻值:40kΩ;精度:±0.1%;功率:100mW;温度系数:±25ppm/℃;; LCSC Part Name: 薄膜电阻 40kΩ ±0.1% 100mW; Supplier Part: C861392; Manufacturer: YAGEO(国巨); Supplier Footprint: 0603; JLCPCB Part Class: Extended Part; Datasheet: https://atta.szlcsc.com/upload/public/pdf/source/20200610/C326738_5639A9F1B6EB6E4AE2197577D3456E7F.pdf; Supplier: LCSC; Type: 薄膜电阻; Tolerance: ±0.1%; Power(Watts): 100mW; Temperature Coefficient: ±25ppm/℃; Operating Temperature Range: -55℃~+155℃
R9 = RC0603FR-0711KL: 电阻类型:厚膜电阻;阻值:11kΩ;精度:±1%;功率:100mW;工作电压:75V;温度系数:±100ppm/℃;; LCSC Part Name: 厚膜电阻 11kΩ ±1% 100mW; Supplier Part: C137801; Manufacturer: YAGEO(国巨); Supplier Footprint: 0603; JLCPCB Part Class: Extended Part; Datasheet: https://item.szlcsc.com/datasheet/RC0603FR-0711KL/149117.html; Supplier: LCSC; Type: 厚膜电阻; Tolerance: ±1%; Power(Watts): 100mW; Voltage-Supply(Max): 75V; Temperature Coefficient: ±100ppm/℃; Operating Temperature: -55℃~+155℃
R10 = 0603WAF1003T5E: 电阻类型:厚膜电阻;阻值:100kΩ;精度:±1%;功率:100mW;工作电压:75V;温度系数:±100ppm/℃;; LCSC Part Name: 100kΩ ±1% 100mW 厚膜电阻; Supplier Part: C25803; Manufacturer: UNI-ROYAL(厚声); Supplier Footprint: 0603; JLCPCB Part Class: Basic Part; Datasheet: https://item.szlcsc.com/datasheet/0603WAF1003T5E/26546.html; Supplier: LCSC; Type: 厚膜电阻; Tolerance: ±1%; Power(Watts): 100mW; Voltage-Supply(Max): 75V; Temperature Coefficient: ±100ppm/℃; Operating Temperature: -55℃~+155℃
R11 = 0603WAF4992T5E: 电阻类型:厚膜电阻;阻值:49.9kΩ;精度:±1%;功率:100mW;工作电压:75V;温度系数:±100ppm/℃;; LCSC Part Name: 49.9kΩ ±1% 100mW 厚膜电阻; Supplier Part: C23184; Manufacturer: UNI-ROYAL(厚声); Supplier Footprint: 0603; JLCPCB Part Class: Basic Part; Datasheet: https://item.szlcsc.com/datasheet/0603WAF4992T5E/23911.html; Supplier: LCSC; Type: 厚膜电阻; Tolerance: ±1%; Power(Watts): 100mW; Voltage-Supply(Max): 75V; Temperature Coefficient: ±100ppm/℃; Operating Temperature: -55℃~+155℃
R15 = 0402WGF2002TCE: 电阻类型:厚膜电阻;阻值:20kΩ;精度:±1%;功率:62.5mW;最大工作电压:50V;温度系数:±100ppm/℃;; LCSC Part Name: 20kΩ ±1% 62.5mW 厚膜电阻; Supplier Part: C25765; Manufacturer: UNI-ROYAL(厚声); Supplier Footprint: 0402; JLCPCB Part Class: Basic Part; Datasheet: https://atta.szlcsc.com/upload/public/pdf/source/20200306/C422600_1E6D84923E4A46A82E41ADD87F860B5C.pdf; Supplier: LCSC; Type: 厚膜电阻; Tolerance: ±1%; Power(Watts): 62.5mW; Overload Voltage (Max): 50V; Temperature Coefficient: ±100ppm/℃; Operating Temperature Range: -55℃~+155℃
R17 = 0402WGF1202TCE: 电阻类型:厚膜电阻;阻值:12kΩ;精度:±1%;功率:62.5mW;工作电压:50V;温度系数:±100ppm/℃;; LCSC Part Name: 12kΩ ±1% 62.5mW 厚膜电阻; Supplier Part: C25752; Manufacturer: UNI-ROYAL(厚声); Supplier Footprint: 0402; JLCPCB Part Class: Basic Part; Datasheet: https://item.szlcsc.com/datasheet/0402WGF1202TCE/26495.html; Supplier: LCSC; Type: 厚膜电阻; Tolerance: ±1%; Power(Watts): 62.5mW; Voltage-Supply(Max): 50V; Temperature Coefficient: ±100ppm/℃; Operating Temperature: -55℃~+155℃
R28 = 0402WGF4532TCE: 电阻类型:厚膜电阻;阻值:45.3kΩ;精度:±1%;功率:62.5mW;工作电压:50V;温度系数:±100ppm/℃;; LCSC Part Name: 45.3kΩ ±1% 62.5mW 厚膜电阻; Supplier Part: C26980; Manufacturer: UNI-ROYAL(厚声); Supplier Footprint: 0402; JLCPCB Part Class: Extended Part; Datasheet: https://item.szlcsc.com/datasheet/0402WGF4532TCE/27729.html; Supplier: LCSC; Type: 厚膜电阻; Tolerance: ±1%; Power(Watts): 62.5mW; Voltage-Supply(Max): 50V; Temperature Coefficient: ±100ppm/℃; Operating Temperature: -55℃~+155℃
R119 = 0603WAF3300T5E: 电阻类型:厚膜电阻;阻值:330Ω;精度:±1%;功率:100mW;最大工作电压:75V;温度系数:±100ppm/℃;; LCSC Part Name: 330Ω ±1% 100mW 厚膜电阻; Supplier Part: C23138; Manufacturer: UNI-ROYAL(厚声); Supplier Footprint: 0603; JLCPCB Part Class: Basic Part; Datasheet: https://atta.szlcsc.com/upload/public/pdf/source/20200306/C422600_1E6D84923E4A46A82E41ADD87F860B5C.pdf; Supplier: LCSC; Type: 厚膜电阻; Tolerance: ±1%; Power(Watts): 100mW; Overload Voltage (Max): 75V; Temperature Coefficient: ±100ppm/℃; Operating Temperature Range: -55℃~+155℃
R120-R122 = 0603WAF1500T5E: 电阻类型:厚膜电阻;阻值:150Ω;精度:±1%;功率:100mW;最大工作电压:75V;温度系数:±100ppm/℃;; LCSC Part Name: 150Ω ±1% 100mW 厚膜电阻; Supplier Part: C22808; Manufacturer: UNI-ROYAL(厚声); Supplier Footprint: 0603; JLCPCB Part Class: Basic Part; Datasheet: https://atta.szlcsc.com/upload/public/pdf/source/20200306/C422600_1E6D84923E4A46A82E41ADD87F860B5C.pdf; Supplier: LCSC; Type: 厚膜电阻; Tolerance: ±1%; Power(Watts): 100mW; Overload Voltage (Max): 75V; Temperature Coefficient: ±100ppm/℃; Operating Temperature Range: -55℃~+155℃
R123 = 0402WGF2000TCE: 电阻类型:厚膜电阻;阻值:200Ω;精度:±1%;功率:62.5mW;工作电压:50V;温度系数:±100ppm/℃;; LCSC Part Name: 200Ω ±1% 62.5mW 厚膜电阻; Supplier Part: C25087; Manufacturer: UNI-ROYAL(厚声); Supplier Footprint: 0402; JLCPCB Part Class: Basic Part; Datasheet: https://item.szlcsc.com/datasheet/0402WGF2000TCE/25830.html; Supplier: LCSC; Type: 厚膜电阻; Tolerance: ±1%; Power(Watts): 62.5mW; Voltage-Supply(Max): 50V; Temperature Coefficient: ±100ppm/℃; Operating Temperature: -55℃~+155℃
U1 U2 = TPS82130SILR: TPS82130 TPS82130 具有集成电感的 3A 17V 降压转换器; LCSC Part Name: 带集成电感的17V输入、3A降压转换器MicroSiP模块; Supplier Part: C473914; Manufacturer: TI(德州仪器); Supplier Footprint: USIP-8; JLCPCB Part Class: Extended Part; Datasheet: https://www.ti.com/cn/lit/gpn/tps82130; Supplier: LCSC; Function: 降压型; Number of Outputs: 1; Voltage - Supply: 3V~17V; Output Voltage Accuracy: ±1.5%; Output Voltage: 900mV~6V; Output Current(Max): 3A; Supply Current (Iq): 20uA; Switching Frequency: 2MHz; Features: 过热保护; Length: 3mm; Width: 2.8mm; Height: 1.5mm; Operating Temperature Range: -40℃~+125℃
U3 = RT9193-33GB: 输出类型:固定;工作电压:5.5V;输出电压:3.3V;输出电流:300mA;电源纹波抑制比(PSRR):-50dB@(10kHz);输出极性:正极;; LCSC Part Name: 输入5.5V 输出3.3V 300mA; Supplier Part: C15651; Manufacturer: RICHTEK(立锜); Supplier Footprint: SOT-23-5; JLCPCB Part Class: 扩展库; Datasheet: https://item.szlcsc.com/datasheet/RT9193-33GB/16332.html; Supplier: LCSC; Output Type: 固定; Voltage - Supply: 5.5V; Output Voltage: 3.3V; Output Current: 300mA; Power Supply Rejection Ratio (PSRR): -50dB@(10kHz); Voltage Dropout: 220mV@(300mA); standby current: 90uA; Noise: 100uVrms; Features: 过流保护；带使能；过热保护; Operating Temperature: -40℃~+125℃@(Tj); Output Configuration: 正极; Number of Outputs: 1; Check: false
U4 = TLV62569DBVR: 功能类型:降压型;工作电压:2.5V~5.5V;输出电压:600mV~5.5V;输出电流:2A;输出类型:可调;; LCSC Part Name: 高效率同步降压转换器; Supplier Part: C141836; Manufacturer: TI(德州仪器); Supplier Footprint: SOT-23-5; JLCPCB Part Class: 扩展库; Datasheet: https://www.ti.com/cn/lit/gpn/tlv62569; Supplier: LCSC; Function: 降压型; Voltage - Supply: 2.5V~5.5V; Output Voltage: 600mV~5.5V; Output Current: 2A; Frequency - Switching: 1.5MHz; Operating Temperature: -40℃~+125℃@(TJ); Synchronous Rectifier: 是; Number of Outputs: 1; Topology: 降压式; Switch tube (built-in/external): 内置; Output Type: 可调
U5 = EA3059QDR: 4 路PMU, 输入电压2.7V~5.5V，输出电压 0.6V~Vin  输出电流：2A/2A/2A/2A; LCSC Part Name: 四路电源管理集成电路; Supplier Part: C111586; Manufacturer: everanalog(申风); Supplier Footprint: QFN-24-EP(4x4); JLCPCB Part Class: Extended Part; Datasheet: https://item.szlcsc.com/datasheet/EA3059QDR/112813.html; Supplier: LCSC
USB1 = TYPE-C 6P QT073: 连接器类型:Type-C;协议标准:USB 3.1;公母:母;安装方式:卧贴;触点数量:6P;端口数量:1;额定电流 - 电源:3A;工作温度:-25℃~+85℃;; LCSC Part Name: 6P卧贴母座; Supplier Part: C2681548; Manufacturer: SHOU HAN(首韩); Supplier Footprint: SMD; JLCPCB Part Class: Extended Part; Datasheet: https://item.szlcsc.com/datasheet/TYPE-C%25206P%2520QT073/2774891.html; Supplier: LCSC; Connector Type: Type-C; Protocol Standard: USB 3.1; Gender: 母; Mounting Type: 卧贴; Number of Contacts: 6P; Number of Ports: 1; Current Rating-Power: 3A; Voltage Rating: 5V; Connect-Disconnect Life: 1万次; Detection color: 黑色; Operating Temperature: -25℃~+85℃

## Nets
+0V9_NGFF: C16.2 C40.2 C48.1 C51.1 C52.1 C56.1 L1.1 L9.1 R11.1 R123.1 U11.8(DVDD09) U11.28(DVDD09) U11.37(EVDD09) U11.47(DVDD09)
+0V9_SYS: C22.2 L3.1 R14.2 ; also on sheet 1
+1V1_CPU: C23.2 L4.1 R16.2 ; also on sheet 1
+1V5_DRAM: C24.2 L5.1 R19.2 ; also on sheet 1
+3V3_NGFF: C11.2 C49.1 C50.1 C55.1 L8.1 R37.1 R38.1 R121.1 R122.1 U3.5(VOUT) U4.1(EN) U11.29(DVDD33) U11.43(EVDD33) U11.46(DVDD33)
+3V3_SOC: C21.2 C28.2 C29.2 L2.1 R20.2 R21.2 R26.2 R27.2 R28.2 R120.1 ; also on sheet 1
+3V7_NGFF: C6.2 C13.1 C14.1 R8.2 R22.2 R23.2 R43.2 R44.2 R117.1 R118.1 U2.4(VOUT) U2.5(VOUT) U3.1(VIN) U3.3(EN) U4.4(VIN) U6.2 U6.4 U6.70 U6.72 U6.74
+5V: C3.2 C17.2 C18.2 C19.2 C20.2 R6.2 R119.1 U1.4(VOUT) U1.5(VOUT) U5.3(VCC) U5.8(VIN2) U5.9(EN2) U5.11(VIN1) U5.20(VIN4) U5.21(EN4) U5.23(VIN3) ; also on sheet 1
GND: C1.1 C2.2 C3.1 C4.2 C5.2 C6.1 C7.2 C11.1 C13.2 C14.2 C16.1 C17.1 C18.1 C19.1 C20.1 C21.1 C22.1 C23.1 C24.1 C27.1 C28.1 C29.1 C40.1 C41.1 C42.1 C43.1 C44.1 C45.1 C48.2 C49.2 C50.2 C51.2 C52.2 C53.2 C54.2 C55.2 C56.2 C57.1 C58.1 C59.1 H1.3 L6.13 L6.P10 L6.SHIELD0 L6.SHIELD1 LED2.1(K) LED7.1(K) LED8.1(K) LED9.1(K) Q1.2(GND) Q2.1(E) R3.1 R4.1 R7.1 R9.1 R10.1 R12.1 R15.1 R17.1 R18.2 R20.1 R21.1 R31.2 R32.2 R36.1 R39.1 U1.3(GND) U1.9(EP) U2.3(GND) U2.9(EP) U3.2(GND) U4.2(GND) U5.1(GND3) U5.4(AGND) U5.6(GND2) U5.13(GND1) U5.18(GND4) U5.25(EP) U6.3 U6.5 U6.11 U6.27 U6.33 U6.39 U6.45 U6.51 U6.57 U6.71 U6.73 U6.76 U6.77 U10.1(GND) U10.9(GND) U10.10(GND) U10.11(GND) U10.C5(GND) U11.40(GND) U11.49(GND) USB1.7(EH) USB1.A12(GND) USB1.B12(GND) X1.2(GND) X1.4(GND) ; also on sheet 1
VDD: C1.2 Q1.1(VDD) R1.1 R2.2
VDD_EXT: R33.2 R34.2 R35.2 U6.65
5GLED: LED1.1(K) R42.2 U6.10
CC1: Q1.4(CC1) R4.2 USB1.A5(CC1)
CC2: Q1.5(CC2) R3.2 USB1.B5(CC2)
CLKREQB: R35.1 U6.52 U11.48(CLKREQB)
EN1: R26.1 U5.10(EN1)
EN3: R27.1 U5.22(EN3)
FB1: R14.1 R15.2 U5.14(FB1)
FB2: R18.1 R19.1 U5.5(FB2)
FB3: R16.1 R17.2 U5.2(FB3)
FB4: R12.2 R28.1 U5.17(FB4)
HSIN: R40.2 U6.41
HSIP: R41.2 U6.43
HSON: C46.2 U6.47
HSOP: C47.2 U6.49
LANWAKEB: R34.1 U6.54 U11.2(LANWAKEB)
LX1: L3.2 U5.12(LX1)
LX2: L5.2 U5.7(LX2)
LX3: L4.2 U5.24(LX3)
LX4: L2.2 U5.19(LX4)
MDI1N0: L6.P3(MDI0-) U11.14(MDIN0)
MDI1N1: L6.P7(MDI1-) U11.18(MDIN1)
MDI1N2: L6.P6(MDI2-) U11.21(MDIN2)
MDI1N3: L6.P9(MDI3-) U11.24(MDIN3)
MDI1P0: L6.P2(MDI0+) U11.13(MDIP0)
MDI1P1: L6.P4(MDI1+) U11.17(MDIP1)
MDI1P2: L6.P5(MDI2+) U11.20(MDIP2)
MDI1P3: L6.P8(MDI3+) U11.23(MDIP3)
NGFF_AVDD09: C41.2 C42.2 C44.2 L9.2 U11.11(AVDD09) U11.16(AVDD09) U11.22(AVDD09)
NGFF_AVDD33: C43.2 C45.2 C53.1 C54.1 L8.2 U11.15(AVDD33) U11.19(AVDD33) U11.33(AVDD33) U11.34(AVDD33_XTAL)
NGFF_CKXTAL1: C58.2 U11.10(CKXTAL1) X1.3(OSC2)
NGFF_CKXTAL2: C57.2 U11.9(CKXTAL2) X1.1(OSC1)
PCIERSTB: R33.1 U6.50 U11.36(PERSTB)
PDIN: C4.1 C7.1 R1.2 U1.1(EN) U1.2(VIN) U2.1(EN) U2.2(VIN) USB1.A9(VBUS) USB1.B9(VBUS)
REFCLK_N: R31.1 U6.53 U11.45(REFCLK_N)
REFCLK_P: R32.1 U6.55 U11.44(REFCLK_P)
SIM-CD: U6.66 U10.CD
SIM-CLK: U6.32 U10.C3(CLK)
SIM-DATA: U6.34 U10.C7(I/O)
SIM-RST: U6.30 U10.C2(RST)
SIM-VCC: C27.2 U6.36 U10.C1(VCC)
UARTNGFF-RX: H1.1 U6.62
UARTNGFF-TX: H1.2 U6.64
USBNGFF.D+: U6.7 ; also on sheet 1
USBNGFF.D-: U6.9 ; also on sheet 1
$1N9: Q1.6(CFG) R2.1
$1N13: C2.1 U1.8(SS/TR)
$1N16: R6.1 R7.2 U1.6(FB)
$1N28: R8.1 R9.2 U2.6(FB)
$1N31: C5.1 U2.8(SS/TR)
$1N37: R10.2 R11.2 U4.5(FB)
$1N39: L1.2 U4.3(SW)
$1N99: LED7.2(A) R119.2
$1N101: LED8.2(A) R120.2
$1N105: LED9.2(A) R121.2
$1N108: LED10.2(A) R122.2
$1N110: LED10.1(K) Q2.3(C)
$1N112: Q2.2(B) R123.2
$2N23: R23.1 U6.6
$2N24: R22.1 U6.8
$2N32: LED2.2(A) R118.2
$2N34: LED1.2(A) R117.2
$2N67: R36.2 R37.2 U11.1(ISOLATEB)
$2N73: R38.2 U11.3(GPI)
$2N92: R39.2 U11.12(RSET)
$2N96: C46.1 U11.39(HSON)
$2N99: C47.1 U11.38(HSOP)
$2N100: R40.1 U11.42(HSIN)
$2N103: R41.1 U11.41(HSIP)
$2N104: L6.12 R42.1
$2N106: L6.11 R43.1
$2N108: L6.14 R44.1
$2N139: C59.2 L6.P1

Not connected (* = marked no-connect by the designer): Q1 3(PG)*; U1 7(PG)*; U2 7(PG)*; U3 4(BP)*; U5 15(NC)* 16(NC)*; U6 1* 20* 21* 22* 23* 24* 25* 26* 28* 29* 31* 35* 37* 38* 40* 42* 44* 46* 48* 56* 58* 59* 60* 61* 63* 67* 68* 69* 75*; U10 C6(VPP)*; U11 4(NC)* 5(NC)* 6(POW_EXT_SWR)* 7(NC)* 25(LED2/EEDO/SPIS0) 26(SPICSB) 27(LED1/EESK/SPISC) 30(LED0/EEDI/SPISI/SDA) 31(EECS/SCL) 32(EEPROM_SEL/PPS_PIN) 35(LED3)

## Notes on the sheets
sheet 2
- PD 12V to 5V
- +1V1_CPU and +0V9_SYS ENABLED
  after +1V5_DRAM output ~1ms
- SoC Power Tree
  +3V3_SOC
  +1V5_DRAM
  +1V1_CPU
  +0V9_SYS
- NGFF Power Tree
  +3V7_NGFF
  +3V3_NGFF
  +0V9_NGFF
sheet 3
- NGFF 5G Connector
- NGFF PCIe to 2.5GbE
